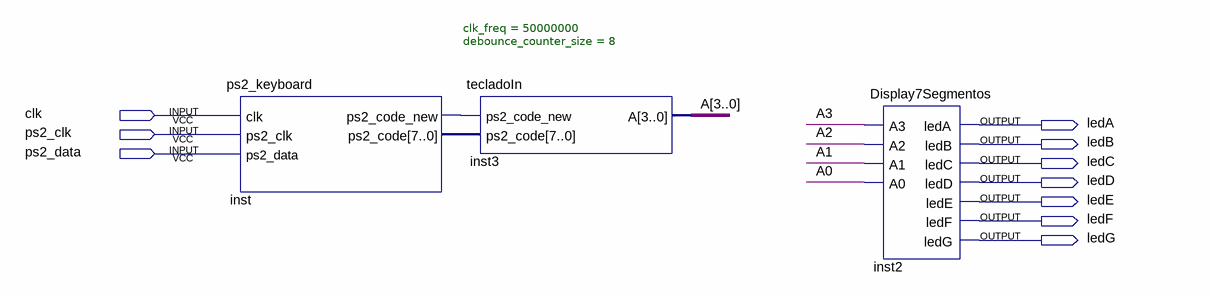
[diagram p0: schematic sheet]
// Quartus schematic Block1.bdf as structural Verilog: 3 symbols, 10 pins
module Block1 (
  input  clk,
  input  ps2_clk,
  input  ps2_data,
  output ledA,
  output ledB,
  output ledC,
  output ledD,
  output ledE,
  output ledF,
  output ledG
);

  wire inst_ps2_code_new;
  wire [3:0] A;
  wire [7:0] inst_ps2_code;

  ps2_keyboard #(.clk_freq(50000000), .debounce_counter_size(8)) inst (
    .clk(clk), .ps2_clk(ps2_clk), .ps2_data(ps2_data), .ps2_code_new(inst_ps2_code_new),
    .ps2_code(inst_ps2_code));
  tecladoIn inst3 (.ps2_code_new(inst_ps2_code_new), .ps2_code(inst_ps2_code), .A(A));
  Display7Segmentos inst2 (
    .A3(A[3]), .A2(A[2]), .A1(A[1]), .A0(A[0]), .ledA(ledA), .ledB(ledB), .ledC(ledC), .ledD(ledD),
    .ledE(ledE), .ledF(ledF), .ledG(ledG));
endmodule
